# Altium schematic sheet main.SchDoc: Soldeerstation
size A4; DrawnBy: Benjie Van Limbergen; SheetNumber: 1; SheetTotal: 4
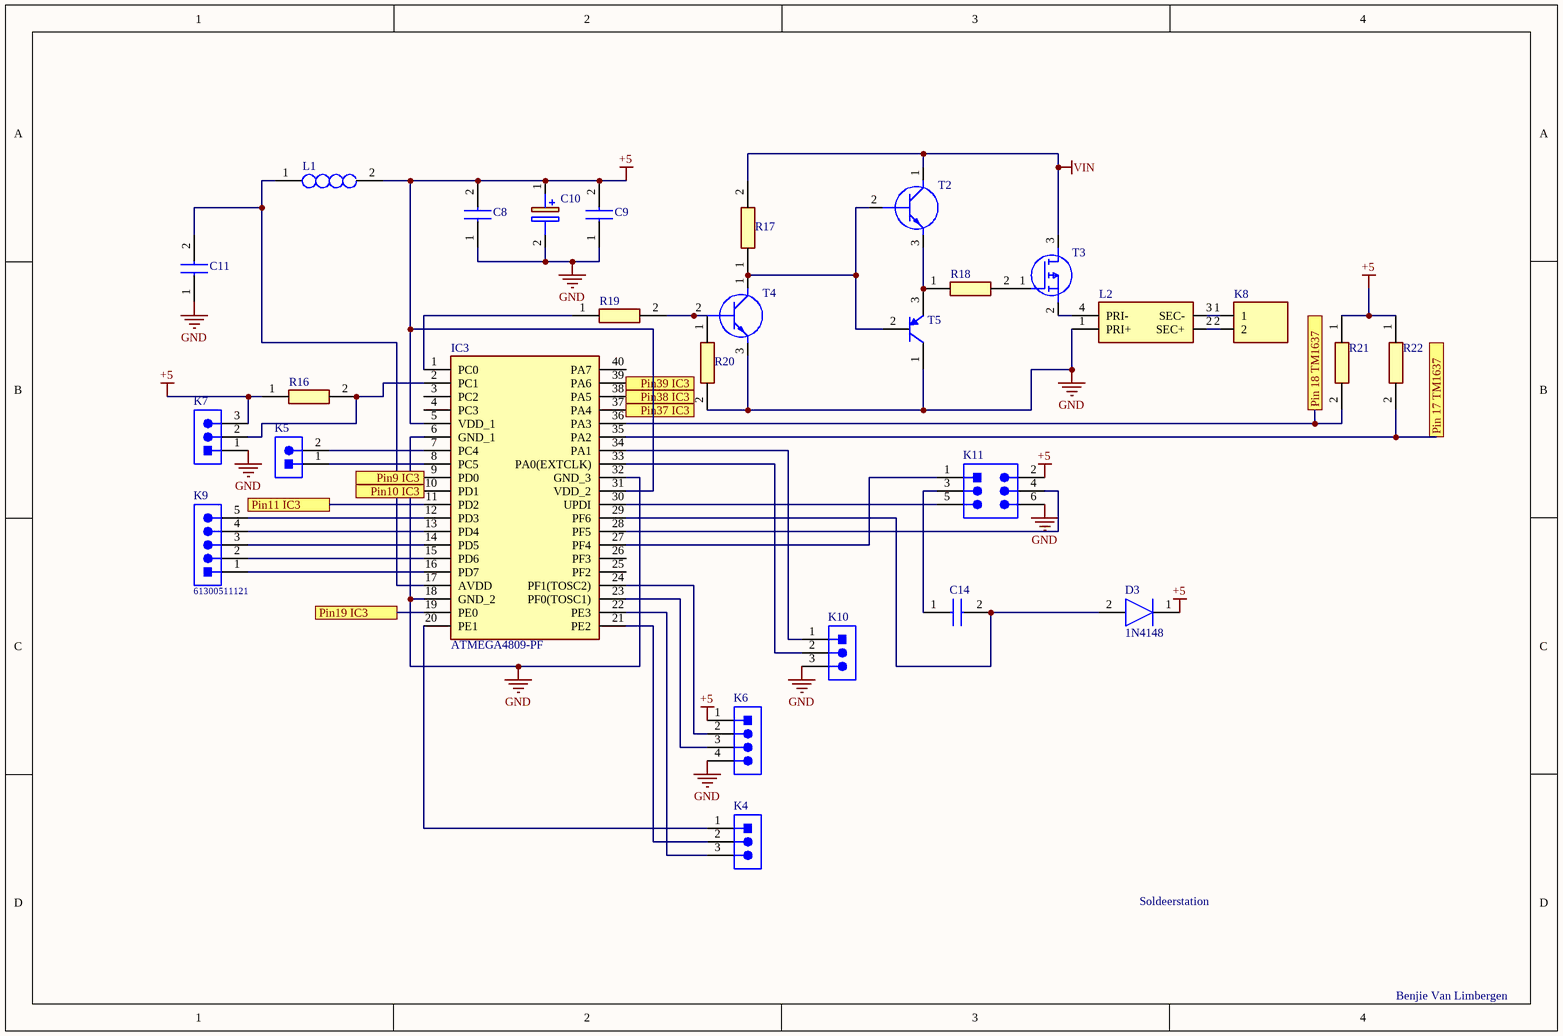
[diagram p0: main.SchDoc]

## Parts
C8  885012207098  [CAPC2012X90N]  (value not drawn)
C9  885012207098  [CAPC2012X90N]  (value not drawn)
C10  860240672002  [CAPPRD200W52D500H1250]  (value not drawn)
C11  885012207098  [CAPC2012X90N]  (value not drawn)
C14  885012207092  [CAPC2012X90N]  (value not drawn)
D3  1N4148  [DIOAD1165W56L425D185]
IC3  ATMEGA4809-PF  [DIP1543W58P254L5175H635Q40N]
K4  61300311121  [HDR1X3]  (value not drawn)
K5  61300211121  [HDR1X2]  (value not drawn)
K6  61000418221  [HDR1X4]  (value not drawn)
K7  61300311121  [HDR1X3]  (value not drawn)
K8  691214110002  [691214110002]  (value not drawn)
K9  61300511121  [HDR1X5]
K10  61300311121  [HDR1X3]  (value not drawn)
K11  61000621121  [HDR2X3]  (value not drawn)
L1  744711003  [744711003]  (value not drawn)
L2  CM2545X171B-10  [CM2545X171B10]  (value not drawn)
R16  C  [RESC2012X60N]  (value not drawn)
R17  smd  [RESC2012X60N]  (value not drawn)
R18  smd  [RESC2012X60N]  (value not drawn)
R19  smd  [RESC2012X60N]  (value not drawn)
R20  smd  [RESC2012X60N]  (value not drawn)
R21  CRCW08051M00JNEAC  [RESC2012X60N]  (value not drawn)
R22  CRCW08051M00JNEAC  [RESC2012X60N]  (value not drawn)
T2  BC547CBU  [BC547CBU]  (value not drawn)
T3  IRF9Z34NPBF  [TO254P469X1042X1967-3P]  (value not drawn)
T4  BC547CBU  [BC547CBU]  (value not drawn)
T5  BC557CG  [ONSC-TO-92-3-29-11]  (value not drawn)

## Ports
Pin9 IC3, Pin10 IC3, Pin11 IC3, Pin19 IC3, Pin37 IC3, Pin38 IC3, Pin39 IC3, Pin 17 TM1637, Pin 18 TM1637

## Nets
+5: C8.2 C9.2 C10.1(+) D3.1(K) IC3.5(VDD_1) IC3.31(VDD_2) K6.1 K7.3 K11.2 L1.2 R16.1 R21.1 R22.1
GND: C8.1 C9.1 C10.2(-) C11.1 IC3.6(GND_1) IC3.18(GND_2) IC3.32(GND_3) K6.4 K7.1 K10.3 K11.6 L2.1(PRI+) R20.2 T4.3(E) T5.1(C)
VIN: R17.2 T2.1(C) T3.3(D)
Pin9 IC3: IC3.9(PD0) ; port Pin9 IC3
Pin10 IC3: IC3.10(PD1) ; port Pin10 IC3
Pin11 IC3: IC3.11(PD2) ; port Pin11 IC3
Pin19 IC3: IC3.19(PE0) ; port Pin19 IC3
Pin37 IC3: IC3.37(PA4) ; port Pin37 IC3
Pin38 IC3: IC3.38(PA5) ; port Pin38 IC3
Pin39 IC3: IC3.39(PA6) ; port Pin39 IC3
Pin 17 TM1637: IC3.35(PA2) R22.2 ; port Pin 17 TM1637
Pin 18 TM1637: IC3.36(PA3) R21.2 ; port Pin 18 TM1637
NetC11_2: C11.2 IC3.17(AVDD) L1.1
NetC14_1: C14.1 K11.3
NetC14_2: C14.2 D3.2(A) IC3.29(PF6)
NetIC3_1: IC3.1(PC0) R19.1
NetIC3_2: IC3.2(PC1) K7.2 R16.2
NetIC3_7: IC3.7(PC4) K5.2
NetIC3_8: IC3.8(PC5) K5.1
NetIC3_12: IC3.12(PD3) K9.5
NetIC3_13: IC3.13(PD4) K9.4
NetIC3_14: IC3.14(PD5) K9.3
NetIC3_15: IC3.15(PD6) K9.2
NetIC3_16: IC3.16(PD7) K9.1
NetIC3_20: IC3.20(PE1) K4.1
NetIC3_21: IC3.21(PE2) K4.2
NetIC3_22: IC3.22(PE3) K4.3
NetIC3_23: IC3.23(PF0(TOSC1)) K6.3
NetIC3_24: IC3.24(PF1(TOSC2)) K6.2
NetIC3_27: IC3.27(PF4) K11.1
NetIC3_28: IC3.28(PF5) K11.4
NetIC3_30: IC3.30(UPDI) K11.5
NetIC3_33: IC3.33(PA0(EXTCLK)) K10.2
NetIC3_34: IC3.34(PA1) K10.1
NetK8_1: K8.1 L2.3(SEC-)
NetK8_2: K8.2 L2.2(SEC+)
NetL2_4: L2.4(PRI-) T3.2(S)
NetR17_1: R17.1 T2.2(B) T4.1(C) T5.2(B)
NetR18_1: R18.1 T2.3(E) T5.3(E)
NetR18_2: R18.2 T3.1(G)
NetR19_2: R19.2 R20.1 T4.2(B)

Not connected (* = marked no-connect by the designer): IC3 3(PC2) 4(PC3) 25(PF2) 26(PF3) 40(PA7)

## Library data of the parts
C8 C9 C11 = 885012207098: Capacitor, C3,C8,C9,C11,C14; Manufacturer_Name: Wurth Elektronik; Datasheet Link: https://componentsearchengine.com//885012207098.pdf; Height: 0.9mm; Mouser2 Part Number: 710-885012207098; Mouser2 Price/Stock: https://www.mouser.com/Search/Refine.aspx?Keyword=710-885012207098; Manufacturer_Part_Number: 885012207098
C10 = 860240672002: Capacitor Polarised c10; Manufacturer_Name: Wurth Elektronik; Datasheet Link: https://katalog.we-online.de/pbs/datasheet/860240672002.pdf; Height: 12.5mm; Manufacturer_Part_Number: 860240672002
C14 = 885012207092: Capacitor c14 100n; Manufacturer_Name: Wurth Elektronik; Datasheet Link: https://katalog.we-online.com/pbs/datasheet/885012207092.pdf; Height: 0.9mm; Manufacturer_Part_Number: 885012207092
D3 = 1N4148: Diode D3; Manufacturer_Name: Nexperia; Datasheet Link: https://datasheet.datasheetarchive.com/originals/distributors/Datasheets-112/DSAP0040891.pdf; Manufacturer_Part_Number: 1N4148
IC3 = ATMEGA4809-PF: Integrated Circuit; Manufacturer_Name: Microchip; Datasheet Link: https://componentsearchengine.com//ATMEGA4809-PF.pdf; Height: 6.35mm; Mouser2 Part Number: 556-ATMEGA4809-PF; Mouser2 Price/Stock: https://www.mouser.com/Search/Refine.aspx?Keyword=556-ATMEGA4809-PF; Manufacturer_Part_Number: ATMEGA4809-PF
K4 K7 = 61300311121: WR-PHD Pin Header, THT, pitch 2.54mm, Single Row, Vertical, 3p; Manufacturer: Wurth Elektronik; Pin Number: 3; Rated Current: 3A; Working Voltage: 250VAC; Withstanding Voltage: 500VAC; Contact Resistance: 20mOhm; ComponentLink1Description: Manufacturer; ComponentLink1URL: http://www.we-online.de; ComponentLink2Description: Datasheet; ComponentLink2URL: https://www.we-online.com/catalog/datasheet/61300311121.pdf; Manufacturer Part Number: 61300311121; Pitch: 2.54mm; Operating Temperature: -40 to +105degC; Mounting Technology: THT; Packaging: Bag; Gender: Pin Header; Row Number: Single; Orientation: Vertical
K5 = 61300211121: WR-PHD Pin Header, THT, pitch 2.54mm, Single Row, Vertical, 2p; Manufacturer: Wurth Elektronik; Pin Number: 2; Rated Current: 3A; Working Voltage: 250VAC; Withstanding Voltage: 500VAC; Contact Resistance: 20mOhm; ComponentLink1Description: Manufacturer; ComponentLink1URL: http://www.we-online.de; ComponentLink2Description: Datasheet; ComponentLink2URL: https://www.we-online.com/catalog/datasheet/61300211121.pdf; Manufacturer Part Number: 61300211121; Pitch: 2.54mm; Operating Temperature: -40 to +105degC; Mounting Technology: THT; Packaging: Bag; Gender: Pin Header; Row Number: Single; Orientation: Vertical
K6 = 61000418221: 4p Header K6; Manufacturer: Wurth Elektronik; Pin Number: 4; Pitch: 2.54mm; Gender: Pin Header; Rated Current: 3A; Working Voltage: 250VAC; Withstanding Voltage: 500VAC; Contact Resistance: 20mOhm; Row Number: Single; ComponentLink1Description: Manufacturer; ComponentLink1URL: http://www.we-online.de; ComponentLink2Description: Datasheet; ComponentLink2URL: https://www.we-online.com/catalog/datasheet/61000418221.pdf; Manufacturer Part Number: 61000418221; Operating Temperature: -40 to +125degC; Mounting Technology: SMT; Packaging: Tube; Orientation: Vertical
K8 = 691214110002: Connector; Manufacturer_Name: Wurth Elektronik; Height: 8.7mm; Manufacturer_Part_Number: 691214110002
K9 = 61300511121: 5P Header k9; Manufacturer: Wurth Elektronik; Pin Number: 5; Pitch: 2.54mm; Gender: Pin Header; Rated Current: 3A; Working Voltage: 250VAC; Withstanding Voltage: 500VAC; Contact Resistance: 20mOhm; Row Number: Single; ComponentLink1Description: Manufacturer; ComponentLink1URL: http://www.we-online.de; ComponentLink2Description: Datasheet; ComponentLink2URL: https://www.we-online.com/catalog/datasheet/61300511121.pdf; Manufacturer Part Number: 61300511121; Operating Temperature: -40 to +105degC; Mounting Technology: THT; Packaging: Bag; Orientation: Vertical
K10 = 61300311121: 3p header K10; Manufacturer: Wurth Elektronik; Pin Number: 3; Pitch: 2.54mm; Gender: Pin Header; Rated Current: 3A; Working Voltage: 250VAC; Withstanding Voltage: 500VAC; Contact Resistance: 20mOhm; Row Number: Single; ComponentLink1Description: Manufacturer; ComponentLink1URL: http://www.we-online.de; ComponentLink2Description: Datasheet; ComponentLink2URL: https://www.we-online.com/catalog/datasheet/61300311121.pdf; Manufacturer Part Number: 61300311121; Operating Temperature: -40 to +105degC; Mounting Technology: THT; Packaging: Bag; Orientation: Vertical
K11 = 61000621121: WR-PHD Pin Header, SMT, pitch 2.54mm, Dual Row, Vertical, 6p; Manufacturer: Wurth Elektronik; Pin Number: 6; Rated Current: 3A; Working Voltage: 250VAC; Withstanding Voltage: 500VAC; Contact Resistance: 20mOhm; ComponentLink1Description: Manufacturer; ComponentLink1URL: http://www.we-online.de; ComponentLink2Description: Datasheet; ComponentLink2URL: https://www.we-online.com/catalog/datasheet/61000621121.pdf; Manufacturer Part Number: 61000621121; Pitch: 2.54mm; Operating Temperature: -40 to +125degC; Mounting Technology: SMT; Packaging: Tube; Gender: Pin Header; Row Number: Dual; Orientation: Vertical
L1 = 744711003: Inductor, Smoorspoel 10uH; Manufacturer_Name: Wurth Elektronik; Datasheet Link: https://www.we-online.de/katalog/datasheet/744711003.pdf; Height: 6.2mm; Manufacturer_Part_Number: 744711003
L2 = CM2545X171B-10: Transformer; Manufacturer_Name: Laird Technologies; Datasheet Link: https://datasheet.datasheetarchive.com/originals/dk/DKDS-7/122753.pdf; Height: 9.5mm; Manufacturer_Part_Number: CM2545X171B-10
R16 R20 = CRCW08051M00JNEAC: Resistor R1-22 / 4k7; Manufacturer_Name: Vishay; Datasheet Link: https://componentsearchengine.com//CRCW08051M00JNEAC.pdf; Height: 0.6mm; Mouser2 Part Number: 71-CRCW08051M00JNEAC; Mouser2 Price/Stock: https://www.mouser.com/Search/Refine.aspx?Keyword=71-CRCW08051M00JNEAC; Manufacturer_Part_Number: CRCW08051M00JNEAC
R17 = CRCW08051M00JNEAC: 4k7; Manufacturer_Name: Vishay; Datasheet Link: https://componentsearchengine.com//CRCW08051M00JNEAC.pdf; Height: 0.6mm; Mouser2 Part Number: 71-CRCW08051M00JNEAC; Mouser2 Price/Stock: https://www.mouser.com/Search/Refine.aspx?Keyword=71-CRCW08051M00JNEAC; Manufacturer_Part_Number: CRCW08051M00JNEAC
R18 = CRCW08051M00JNEAC: 100k; Manufacturer_Name: Vishay; Datasheet Link: https://componentsearchengine.com//CRCW08051M00JNEAC.pdf; Height: 0.6mm; Mouser2 Part Number: 71-CRCW08051M00JNEAC; Mouser2 Price/Stock: https://www.mouser.com/Search/Refine.aspx?Keyword=71-CRCW08051M00JNEAC; Manufacturer_Part_Number: CRCW08051M00JNEAC
R19 = CRCW08051M00JNEAC: 10k; Manufacturer_Name: Vishay; Datasheet Link: https://componentsearchengine.com//CRCW08051M00JNEAC.pdf; Height: 0.6mm; Mouser2 Part Number: 71-CRCW08051M00JNEAC; Mouser2 Price/Stock: https://www.mouser.com/Search/Refine.aspx?Keyword=71-CRCW08051M00JNEAC; Manufacturer_Part_Number: CRCW08051M00JNEAC
R21 R22 = CRCW08051M00JNEAC: Resistor R1-22; Manufacturer_Name: Vishay; Datasheet Link: https://componentsearchengine.com//CRCW08051M00JNEAC.pdf; Height: 0.6mm; Mouser2 Part Number: 71-CRCW08051M00JNEAC; Mouser2 Price/Stock: https://www.mouser.com/Search/Refine.aspx?Keyword=71-CRCW08051M00JNEAC; Manufacturer_Part_Number: CRCW08051M00JNEAC
T2 T4 = BC547CBU: Transistor BJT NPN; Manufacturer_Name: ON Semiconductor; Datasheet Link: https://www.onsemi.com/pdf/datasheet/bc550-d.pdf; Height: 5.33mm; Manufacturer_Part_Number: BC547CBU
T3 = IRF9Z34NPBF: MOSFET (P-Channel); Manufacturer_Name: Infineon; Datasheet Link: https://componentsearchengine.com//IRF9Z34NPBF.pdf; Height: 4.69mm; Mouser2 Part Number: 942-IRF9Z34NPBF; Mouser2 Price/Stock: https://www.mouser.com/Search/Refine.aspx?Keyword=942-IRF9Z34NPBF; Manufacturer_Part_Number: IRF9Z34NPBF
T5 = CMP-1048-01441-1: Amplifier Transistor, PNP Silicon, 3-Pin TO-92, Pb-Free, Bulk Box; Manufacturer: On Semiconductor; IC Continuous (A): -0.1; RoHS: TRUE; DatasheetVersion: Rev. 3; ComponentLink2Description: Datasheet; Packing: Bulk Box; PackageReference: TO-92-3-29-11_AM_SL; ComponentLink3URL: http://www.onsemi.cn/pub_link/Collateral/2N6426-D.PDF; ComponentLink2URL: http://www.onsemi.com/pub_link/Collateral/BC556B-D.PDF; PartNumber: BC557CG; PackageDescription: 3-Pin Transistor Outline, Body 4.825 x 3.685 mm, Pitch 1.27 mm; PackageVersion: Rev. AM; ComponentLink3Description: Package Specification; ComponentLink1URL: http://www.onsemi.com/; ComponentLink1Description: Manufacturer URL; Polarity: PNP; Mounting Technology: Through Hole